# EAGLE design bbc (EAGLE 9.6.2)
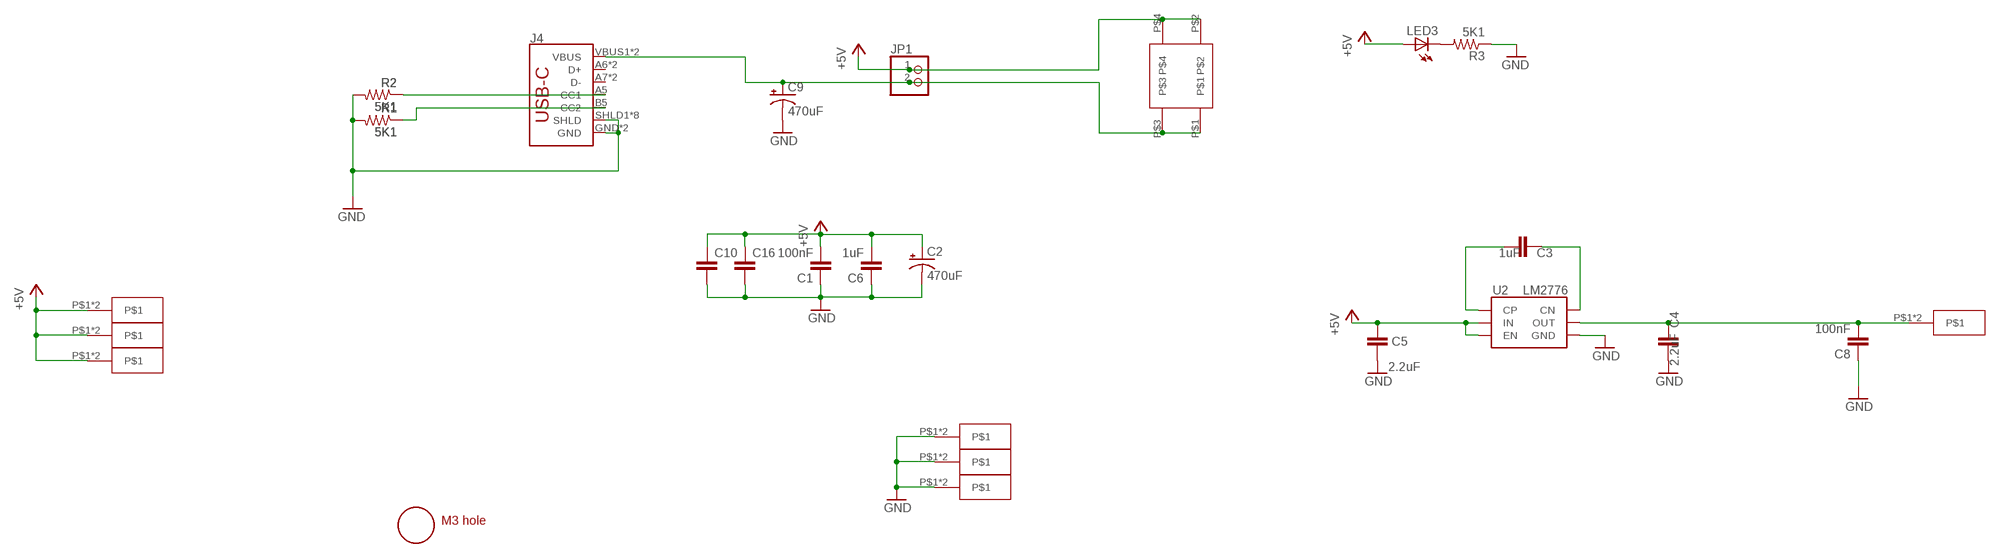
[diagram p0: schematic, sheet 1]

## Parts
C1  100nF  CAP0805  [0805@1]
C2  470uF  CPOL-USSMCD  [SMC_D]
C3  1uF  CAP0805  [0805@1]
C4  2.2uF  CAP0805  [0805@1]
C5  2.2uF  CAP0805  [0805@1]
C6  1uF  CAP0805  [0805@1]
C8  100nF  CAP0805  [0805@1]
C9  470uF  CPOL-USSMCD  [SMC_D]
C10  C5/2.5  [C5B2.5]
C16  C5/2.5  [C5B2.5]
J4  USB_C16PIN  [USB-C-16P]
JP1  PINHD-1X2  [1X02]
LED3  LEDCHIP-LED0805  [CHIP-LED0805]
R1  5K1  RESISTOR0805-RES  [0805]
R2  5K1  RESISTOR0805-RES  [0805]
R3  5K1  RESISTOR0805-RES  [0805]
U2  LM2776  [SOT-23-6]
U$3  ROCK_SW  [ROCK_SWITCH]
U$4  M3_MOUNTING_HOLE  [M3_MOUNTING_HOLE_PACK]
U$5  BLADE28  [2.8BLADE]
U$6  BLADE28  [2.8BLADE]
U$7  BLADE28  [2.8BLADE]
U$8  BLADE28  [2.8BLADE]
U$9  BLADE28  [2.8BLADE]
U$10  BLADE28  [2.8BLADE]
U$11  BLADE28  [2.8BLADE]

## Nets
+5V: C1.2 C2.+ C5.1 C6.2 C10.1 C16.1 JP1.1 LED3.A U2.3(IN) U2.4(EN) U$3.P$2 U$3.P$4 U$6.P$1 U$6.P$2 U$7.P$1 U$7.P$2 U$8.P$1 U$8.P$2
GND: C1.1 C2.- C4.2 C5.2 C6.1 C8.1 C9.- C10.2 C16.2 J4.GND J4.GND2(GND) J4.SHLD1(SHLD) J4.SHLD2(SHLD) J4.SHLD3(SHLD) J4.SHLD4(SHLD) J4.SHLD5(SHLD) J4.SHLD6(SHLD) J4.SHLD7(SHLD) J4.SHLD8(SHLD) R1.2 R2.2 R3.1 U2.2(GND) U$9.P$1 U$9.P$2 U$10.P$1 U$10.P$2 U$11.P$1 U$11.P$2
N$1: C9.+ J4.VBUS1(VBUS) J4.VBUS2(VBUS) JP1.2 U$3.P$1 U$3.P$3
N$2: C3.2 U2.5(CP)
N$3: C3.1 U2.6(CN)
N$4: C4.1 C8.2 U2.1(OUT) U$5.P$1 U$5.P$2
N$6: J4.A5(CC1) R2.1
N$7: LED3.C R3.2
N$31: J4.B5(CC2) R1.1
Unconnected: J4.A6(D+) J4.A7(D-) J4.B6(D+) J4.B7(D-)

## Library data of the parts
C1 C3-C6 C8 = clock:CAP: Capacitor Standard 0603 ceramic capacitor, and 0.1" leaded capacitor.
C2 C9 = rcl:CPOL-US: POLARIZED CAPACITOR, American symbol; SPICEPREFIX: C
C10 C16 = capacitor-wima:C: CAPACITOR naming: grid - package width
J4 = SparkFun-Connectors:USB_C: USB Type C 16Pin Connector Super Speed pins not available on the 16-pin purely SMD connector so this part is best for USB 2.0 implementations. D1 and D2 are tied together enabling D+/- no matter which way the cable is plugged into the connector. The two channel configuration pins (CC1/2) are exposed. These are normally connected to ground via 5.1k resistors but can be reconfigured for high current/high power applications.; PROD_ID: CONN-14122
JP1 = pinhead:PINHD-1X2: PIN HEADER
LED3 = adafruit:LED: LED OSRAM: - CHIPLED LG R971, LG N971, LY N971, LG Q971, LY Q971, LO R971, LY R971 LH N974, LH R974 LS Q976, LO Q976, LY Q976 LO Q996 - Hyper CHIPLED LW Q18S LB Q993, LB Q99A, LB R99A - SideLED LS A670, LO A670, LY A670, LG A670, LP A670 LB A673, LV A673, LT A673, LW A673 LH A674 LY A675 LS A676, LA A676, LO A676, LY A676, LW A676 LS A679, LY A679, LG A679 - Hyper Micro SIDELED® LS Y876, LA Y876, LO Y876, LY Y876 LT Y87S - SmartLED LW L88C, LW L88S LB L89C, LB L89S, LG L890 LS L89K, LO L89K, LY L89K LS L896, LA L896, LO L896, LY L896 - TOPLED LS T670, LO T670, LY T670, LG T670, LP T670 LSG T670, LSP T670, LSY T670, LOP T670, LYG T670 LG T671, LOG T671, LSG T671 LB T673, LV T673, LT T673, LW T673 LH T674 LS T676, LA T676, LO T676, LY T676, LB T676, LH T676, LSB T676, LW T676 LB T67C, LV T67C, LT T67C, LS T67K, LO T67K, LY T67K, LW E67C LS E67B, LA E67B, LO E67B, LY E67B, LB E67C, LV E67C, LT E67C LW T67C LS T679, LY T679, LG T679 LS T770, LO T770, LY T770, LG T770, LP T770 LB T773, LV T773, LT T773, LW T773 LH T774 LS E675, LA E675, LY E675, LS T675 LS T776, LA T776, LO T776, LY T776, LB T776 LHGB T686 LT T68C, LB T68C - Hyper Mini TOPLED® LB M676 - Mini TOPLED Santana® LG M470 LS M47K, LO M47K, LY M47K Source: http://www.osram.convergy.de/
R1-R3 = atx_power_control:RESISTOR: Resistor Basic schematic elements and footprints for 0603, 1206, and PTH resistors.
U2 = dword1511-pmic-dcdc:LM2776: Switched capacitor inverter
U$3 = atx4vc:ROCK_SW
U$4 = a:M3_MOUNTING_HOLE
U$5-U$11 = blade:BLADE28

## Board
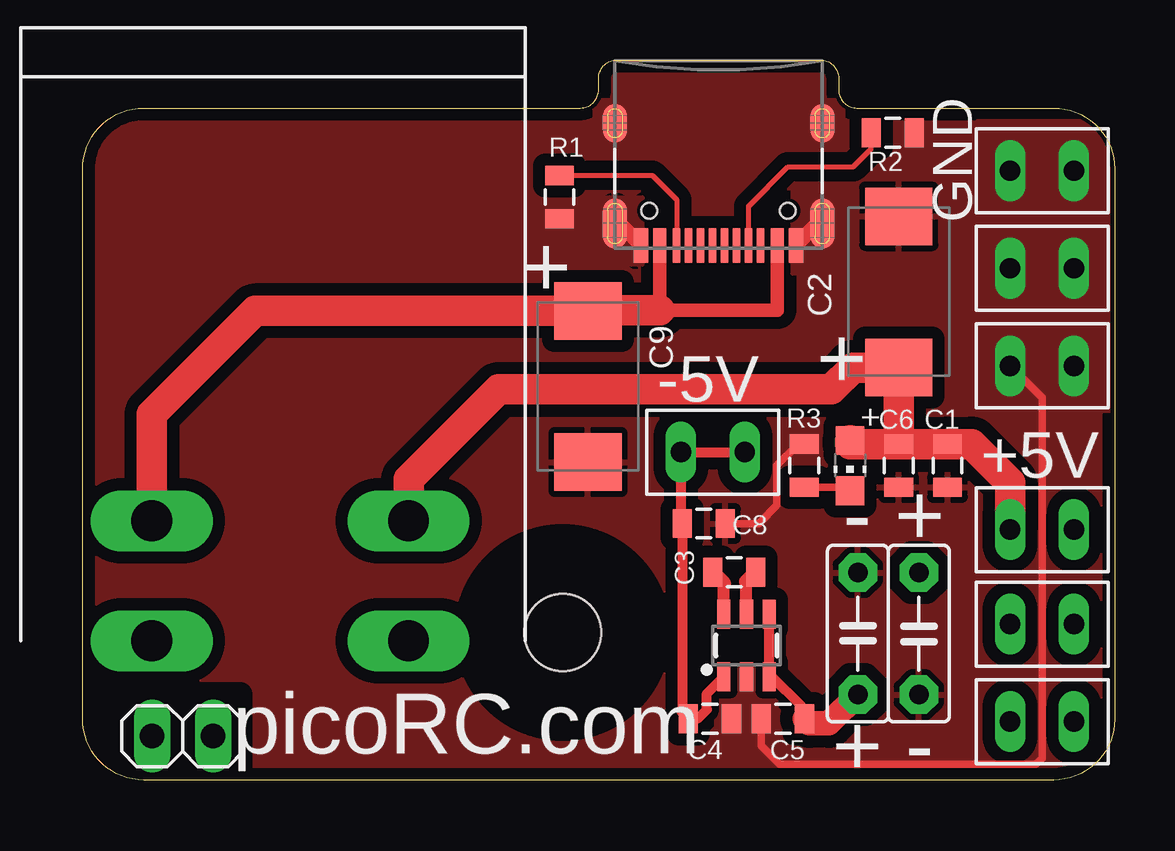
[diagram p1: board, top side]
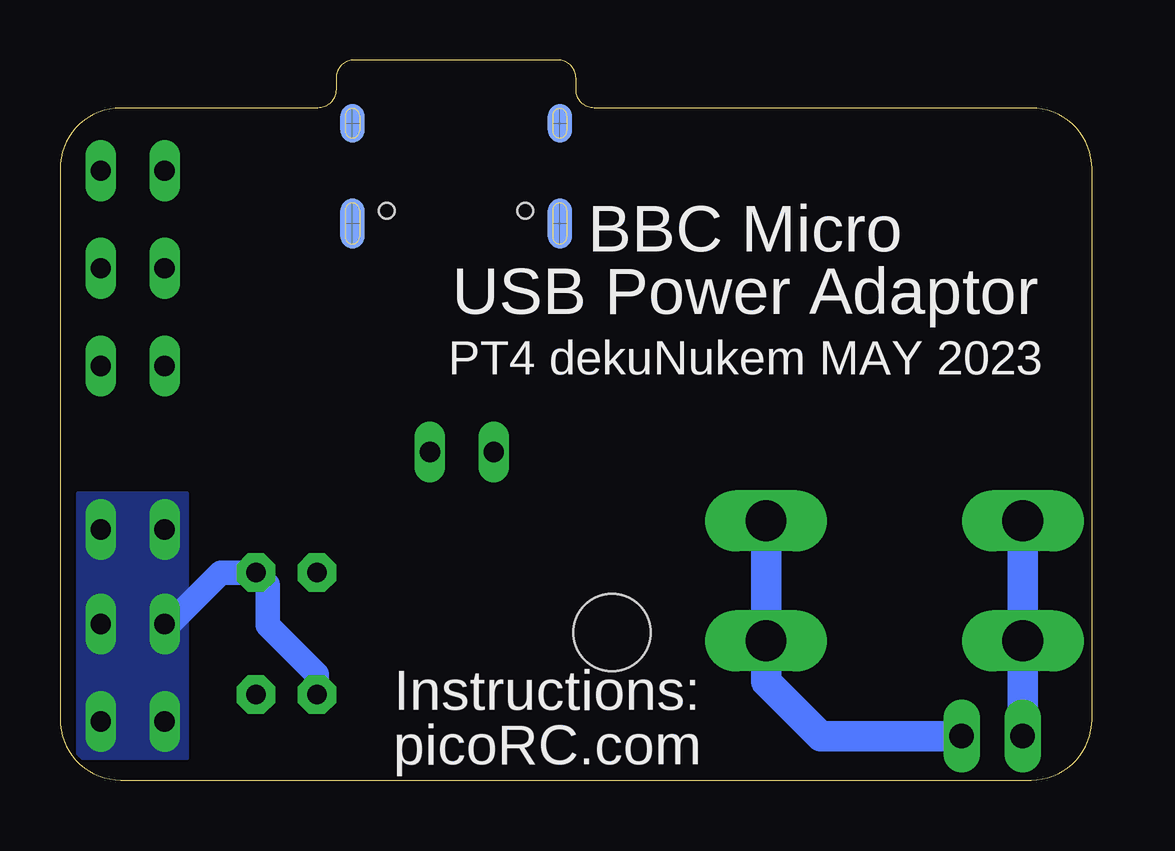
[diagram p2: board, bottom side, seen from below]

Size 43 x 30 mm. Coordinates in mm from the lower left corner, seen from the top.
Outline: 32.26,28 40.46,28 arc-90 43,25.46 43,2.54 arc-90 40.46,0 2.54,0 arc-90 0,2.54 0,25.46 arc-90 2.54,28 20.74,28 arc90 21.5,28.76 21.5,29.24 arc-90 22.26,30 30.74,30 arc-90 31.5,29.24 31.5,28.76 arc90 32.26,28
Copper layers (1*16): Top 0.035mm / dielectric 1.5mm / Bottom 0.035mm
Design rules "SparkFun-2-Layer-General-JLCPCB": minimum track width 7mil, minimum drill 0.3mm, track to track 7mil, track to pad 7mil, pad to pad 7mil, via to via 7mil, smd to smd 7mil, copper to edge 7mil, drill to drill 7mil, minimum pad ring 7mil, minimum via ring 7mil, stop-mask expansion 3mil, vias tented up to drill 25mil, thermal gap 10mil
tRestrict: area 16,2.2 to 24,10.2; area 1.2,-0.1 to 6.6,3.6; area 26.9,5.1 to 28.3,6.1

### Footprints (pad centres in the part's own frame; a part is rotated, then mirrored left to right if it is on the bottom)
0805@1 = smd 0.8 x 1.2: 1 -0.9,0; 2 0.9,0
SMC_D = smd 2.4 x 2.8: + -3.15,0; - 3.15,0
C5B2.5 = drill 0.813 pad 1.6 octagon: 1 -2.54,0; 2 2.54,0
USB-C-16P = smd 0.3 x 1.45: A5 -1.25,0; A6 -0.25,0; A7 0.25,0; A8 1.25,0; B5 1.75,0; B6 0.75,0; B7 -0.75,0; B8 -1.75,0 | smd 0.6 x 1.45: GND -3.225,0; GND2 3.225,0 | smd 1 x 2.1: SHLD1 -4.32,-0.915; SHLD2 4.32,-0.915 | smd 1 x 2.1 bottom: SHLD3 -4.32,-0.915; SHLD4 4.32,-0.915 | smd 1 x 1.6: SHLD5 -4.32,-5.095; SHLD8 4.32,-5.095 | smd 1 x 1.6 bottom: SHLD6 -4.32,-5.095; SHLD7 4.32,-5.095 | smd 0.55 x 1.45: VBUS1 -2.45,0; VBUS2 2.45,0 | hole 0.65: -2.89,-1.445; 2.89,-1.445
1X02 = drill 1.016 long: 1 -1.27,0; 2 1.27,0
CHIP-LED0805 = smd 1.2 x 1.2: A 0,-1.05; C 0,1.05
0805 = smd 0.8 x 1.2: 1 -0.9,0; 2 0.9,0
SOT-23-6 = smd 0.55 x 1.2: 1 -0.95,-1.3; 2 0,-1.3; 3 0.95,-1.3; 4 0.95,1.3; 5 0,1.3; 6 -0.95,1.3
ROCK_SWITCH = drill 1.7 long: P$1 -5.05,0; P$2 5.65,0; P$3 -5.05,5; P$4 5.65,5
M3_MOUNTING_HOLE_PACK = hole 3.2: 0,0
2.8BLADE = drill 0.85 long: P$1 -1.33,0; P$2 1.33,0

### Placement (x,y rotation side)
C1  36.04,13.1 90 top
C2  34.01,20.34 90 top
C3  27.15,8.65 0 top
C4  26.13,2.56 0 top
C5  29.18,2.56 180 top
C6  34.01,13.1 90 top
C8  25.88,10.68 180 top
C9  21.05,16.4 270 top
C10  34.84,6.1 270 top
C16  32.3,6.1 90 top
J4  26.5,22.27 180 top
JP1  4.16,1.83 180 top
LED3  31.97,13.1 180 top
R1  19.87,24.29 270 top
R2  33.75,26.97 0 top
R3  30.07,13.1 270 top
U2  27.66,5.6 0 top
U$3  7.93,5.8 0 top
U$4  20,6.15 0 top
U$5  26.26,13.67 180 top
U$6  39.97,10.43 0 top
U$7  39.97,6.5 0 top
U$8  39.97,2.43 0 top
U$9  39.97,25.39 0 top
U$10  39.97,21.32 0 top
U$11  39.97,17.26 0 top

### Tracks (layer width: path | path; a pad name or v marks a point on that pad's centre or on a via)
+5V
  Top 0.406: C5.1 29.95,2.68 29.95,3.06 28.71,4.3 U2.3 U2.4
  Top 1.016: C5.1 30.28,2.36 31.1,2.36 C16.1
  Top 1.27: LED3.A 31.97,14 C6.2 | C6.2 C1.2 37.04,14 38.64,12.39 U$6.P$1 | U$3.P$4 13.58,12.52 17.33,16.27 31.19,16.27 32.1,17.19 C2.+ C6.2
  Bottom 1.016: U$7.P$1 38.44,6.5 36.3,8.64 C10.1 34.34,8.14 34.34,6.44 32.3,4.4 C16.1
  Bottom 1.27: U$3.P$4 U$3.P$2 13.58,4.1 11.31,1.83 JP1.1
  pour Bottom (no thermals): 37.69,11.95 42.26,11.95 42.26,0.91 37.69,0.91
GND
  Top 0.305: U$11.P$1 39.97,15.93 39.97,0.91 39.72,0.65 29.05,0.65 28.28,1.42 C5.2 | R3.1 29.81,14 28.93,13.11 28.93,11.45 28.16,10.68 C8.1
  Top 0.61: J4.GND2 22.36,23.19 J4.SHLD4 | J4.GND 30.64,23.19 J4.SHLD1
  pour Top (isolate 0.508): 43,29.98 0,29.98 0,-0.06 43,-0.02
  pour Top (no thermals): 37.31,27.45 42.77,27.45 42.77,15.38 37.31,15.38
  pour Top (no thermals): 29.56,24.53 31.59,24.53 31.59,21.1 29.56,21.1
  pour Top (no thermals): 21.43,24.27 21.43,21.48 23.34,21.48 23.34,24.27
  pour Top (no thermals): 29.94,28.34 31.72,28.34 31.72,26.3 29.94,26.3
  pour Top (no thermals): 21.3,28.34 23.08,28.34 23.08,26.3 21.3,26.3
  pour Top (isolate 0.305, no thermals): 28.93,4.97 28.93,1.41 26.39,1.41 26.39,4.97
N$1
  Top 0.559: J4.VBUS2 24.05,19.57 28.95,19.57 J4.VBUS1
  Top 1.27: U$3.P$3 2.88,15.25 7.18,19.55 C9.+ 21.08,19.57 24.05,19.57
  Bottom 1.27: U$3.P$3 U$3.P$1 JP1.2
N$2
  Top 0.508: U2.5 27.66,8.26
  Top 0.61: 27.66,8.26 C3.2
N$3
  Top 0.508: U2.6 26.7,8.19
  Top 0.61: 26.7,8.19 C3.1
N$4
  Top 0.406: U2.1 26,3.6 26,2.94 25.62,2.56 C4.1 24.98,2.81 C8.2 24.93,10.73 U$5.P$2 U$5.P$1
N$6
  Top 0.203: J4.A5 27.75,23.91 29.38,25.54 32.1,25.54 32.85,26.29 R2.1
N$7
  Top 0.305: R3.2 31.97,12.2 LED3.C
N$31
  Top 0.203: J4.B5 24.75,24.18 23.74,25.19 R1.1

### Text on the board
tNames: GND | + | + | -5V | +5V | - | + | picoRC.com | + | -
bNames: BBC Micro / USB Power Adaptor | PT4 dekuNukem MAY 2023 | Instructions: / picoRC.com